# EAGLE design cnode_rev_a (EAGLE 7.6.0)
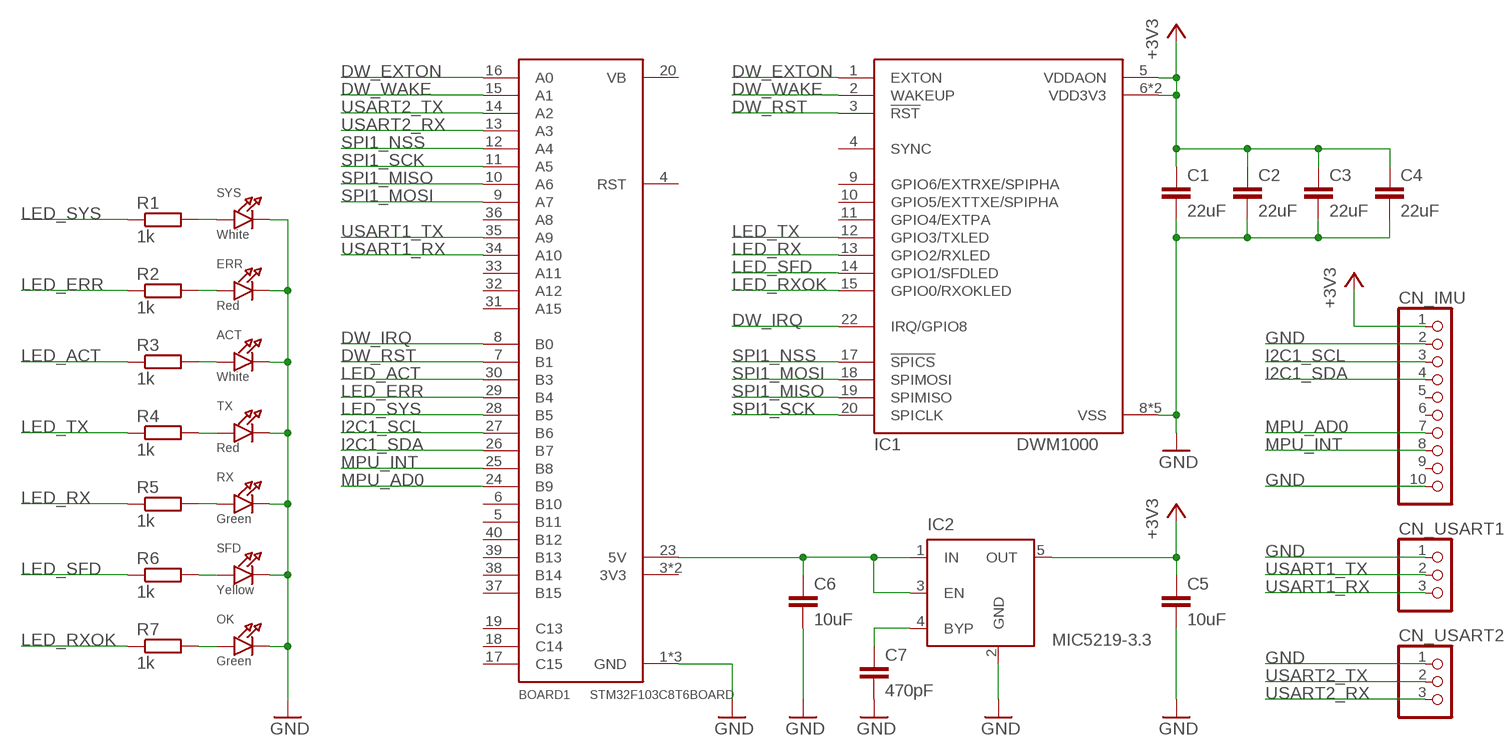
[diagram p0: schematic, sheet 1]

## Parts
ACT  White  LED0805_NOOUTLINE  [CHIPLED_0805_NOOUTLINE]
BOARD1  STM32F103C8T6BOARD  [STM32F103C8T6BOARD]
C1  22uF  C-EUC0805  [C0805]
C2  22uF  C-EUC0805  [C0805]
C3  22uF  C-EUC0805  [C0805]
C4  22uF  C-EUC0805  [C0805]
C5  10uF  C-EUC0805  [C0805]
C6  10uF  C-EUC0805  [C0805]
C7  470pF  C-EUC0805  [C0805]
CN_IMU  HEADER-1X10ROUND  [1X10_ROUND]
CN_USART1  HEADER-1X3ROUND  [1X03_ROUND]
CN_USART2  HEADER-1X3ROUND  [1X03_ROUND]
ERR  Red  LED0805_NOOUTLINE  [CHIPLED_0805_NOOUTLINE]
IC1  DWM1000  [DWM1000]
IC2  MIC5219-3.3  MIC5219XX  [SOT23-5]
OK  Green  LED0805_NOOUTLINE  [CHIPLED_0805_NOOUTLINE]
R1  1k  R-EU_R0805  [R0805]
R2  1k  R-EU_R0805  [R0805]
R3  1k  R-EU_R0805  [R0805]
R4  1k  R-EU_R0805  [R0805]
R5  1k  R-EU_R0805  [R0805]
R6  1k  R-EU_R0805  [R0805]
R7  1k  R-EU_R0805  [R0805]
RX  Green  LED0805_NOOUTLINE  [CHIPLED_0805_NOOUTLINE]
SFD  Yellow  LED0805_NOOUTLINE  [CHIPLED_0805_NOOUTLINE]
SYS  White  LED0805_NOOUTLINE  [CHIPLED_0805_NOOUTLINE]
TX  Red  LED0805_NOOUTLINE  [CHIPLED_0805_NOOUTLINE]

## Nets
+3V3: C1.1 C2.1 C3.1 C4.1 C5.1 CN_IMU.1 IC1.5(VDDAON) IC1.6(VDD3V3) IC1.7(VDD3V3) IC2.5(OUT)
DW_EXTON: BOARD1.16(A0) IC1.1(EXTON)
DW_IRQ: BOARD1.8(B0) IC1.22(IRQ/GPIO8)
DW_RST: BOARD1.7(B1) IC1.3(!RST)
DW_WAKE: BOARD1.15(A1) IC1.2(WAKEUP)
GND: ACT.C BOARD1.1(GND) BOARD1.2(GND) BOARD1.22(GND) C1.2 C2.2 C3.2 C4.2 C5.2 C6.2 C7.2 CN_IMU.2 CN_IMU.10 CN_USART1.1 CN_USART2.1 ERR.C IC1.8(VSS) IC1.16(VSS) IC1.21(VSS) IC1.23(VSS) IC1.24(VSS) IC2.2(GND) OK.C RX.C SFD.C SYS.C TX.C
I2C1_SCL: BOARD1.27(B6) CN_IMU.3
I2C1_SDA: BOARD1.26(B7) CN_IMU.4
LED_ACT: BOARD1.30(B3) R3.1
LED_ERR: BOARD1.29(B4) R2.1
LED_RX: IC1.13(GPIO2/RXLED) R5.1
LED_RXOK: IC1.15(GPIO0/RXOKLED) R7.1
LED_SFD: IC1.14(GPIO1/SFDLED) R6.1
LED_SYS: BOARD1.28(B5) R1.1
LED_TX: IC1.12(GPIO3/TXLED) R4.1
MPU_AD0: BOARD1.24(B9) CN_IMU.7
MPU_INT: BOARD1.25(B8) CN_IMU.8
N$1: R5.2 RX.A
N$2: R4.2 TX.A
N$3: ACT.A R3.2
N$4: ERR.A R2.2
N$5: R1.2 SYS.A
N$6: BOARD1.23(5V) C6.1 IC2.1(IN) IC2.3(EN)
N$7: C7.1 IC2.4(BYP)
N$8: R6.2 SFD.A
N$9: OK.A R7.2
SPI1_MISO: BOARD1.10(A6) IC1.19(SPIMISO)
SPI1_MOSI: BOARD1.9(A7) IC1.18(SPIMOSI)
SPI1_NSS: BOARD1.12(A4) IC1.17(!SPICS)
SPI1_SCK: BOARD1.11(A5) IC1.20(SPICLK)
USART1_RX: BOARD1.34(A10) CN_USART1.3
USART1_TX: BOARD1.35(A9) CN_USART1.2
USART2_RX: BOARD1.13(A3) CN_USART2.3
USART2_TX: BOARD1.14(A2) CN_USART2.2
Unconnected: BOARD1.3(3V3) BOARD1.4(RST) BOARD1.5(B11) BOARD1.6(B10) BOARD1.17(C15) BOARD1.18(C14) BOARD1.19(C13) BOARD1.20(VB) BOARD1.21(3V3) BOARD1.31(A15) BOARD1.32(A12) BOARD1.33(A11) BOARD1.36(A8) BOARD1.37(B15) BOARD1.38(B14) BOARD1.39(B13) BOARD1.40(B12) CN_IMU.5 CN_IMU.6 CN_IMU.9 IC1.4(SYNC) IC1.9(GPIO6/EXTRXE/SPIPHA) IC1.10(GPIO5/EXTTXE/SPIPHA) IC1.11(GPIO4/EXTPA)

## Library data of the parts
ACT ERR OK RX SFD SYS TX = microbuilder:LED: LED 0603 - 0603 Surface Mount Package 2mA: Green LED - Low Power (3.9mcd, 2ma, 1.7Vf) - Digikey: 475-2709-2-ND Orange LED - Low Power (9.8mcd, 2ma, 1.8Vf) - Digikey: 475-1194-2-ND Red LED - Low Power (5mcd, 2ma, 1.8Vf) - Digikey: 475-1195-2-ND Yellow LED - Low Power (7mcd, 2ma, 1.8Vf) - Digikey: 475-1196-2-ND 5mA: Blue LED - Low Power (17mcd, 5ma, 2.9Vf) - Digikey: LNJ937W8CRACT-ND 0805 - 0805 Surface Mount Package 2mA: Red LED (8.8mcd, 2mA, 1.8Vf, Clear) - Low Power [Digikey: 475-2510-1-ND] Green LED (5mcd, 2mA, 1.8Vf, Clear) - Low Power [Digikey: 475-2730-1-ND] Yellow LED (11.3mcd, 2mA, 1.8Vf, Clear) - Low Power [Digikey: 475-2555-1-ND] 20mA: Red LED (104mcd, 20mA, Diffused) - LS R976 [Digikey: 475-1278-6-ND] Red LED (12mcd, 20mA, 2.0Vf, Clear) - APT2012EC [Digikey: 754-1128-1-ND] Green LED (15mcd, 20mA, 2.2Vf, Clear) - APT2012GC [Digikey: 754-1131-1-ND] Orange LED (160mcd, 20mA, 2.1Vf, Clear) - APT2012SECK [Digikey: 754-1130-1-ND] 1206 - 1206 Surface Mount Package Green LED (26mcd, 20mA, Diffused) - LG N971 [Digikey: 475-1407-6-ND] Red LED (15mcd, 20mA, Diffused) - LH N974 [Digikey: 475-1416-6-ND]
BOARD1 = stm32board:STM32F103C8T6BOARD
C1-C7 = rcl:C-EU: CAPACITOR, European symbol
CN_IMU = microbuilder:HEADER-1X10: PIN HEADER
CN_USART1 CN_USART2 = microbuilder:HEADER-1X3: PIN HEADER
IC1 = decawave:DWM1000
IC2 = v-reg-micrel:MIC5219XX: VOLTAGE REGULATOR; OC_FARNELL: unknown; OC_NEWARK: unknown
R1-R7 = rcl:R-EU_: RESISTOR, European symbol

## Board
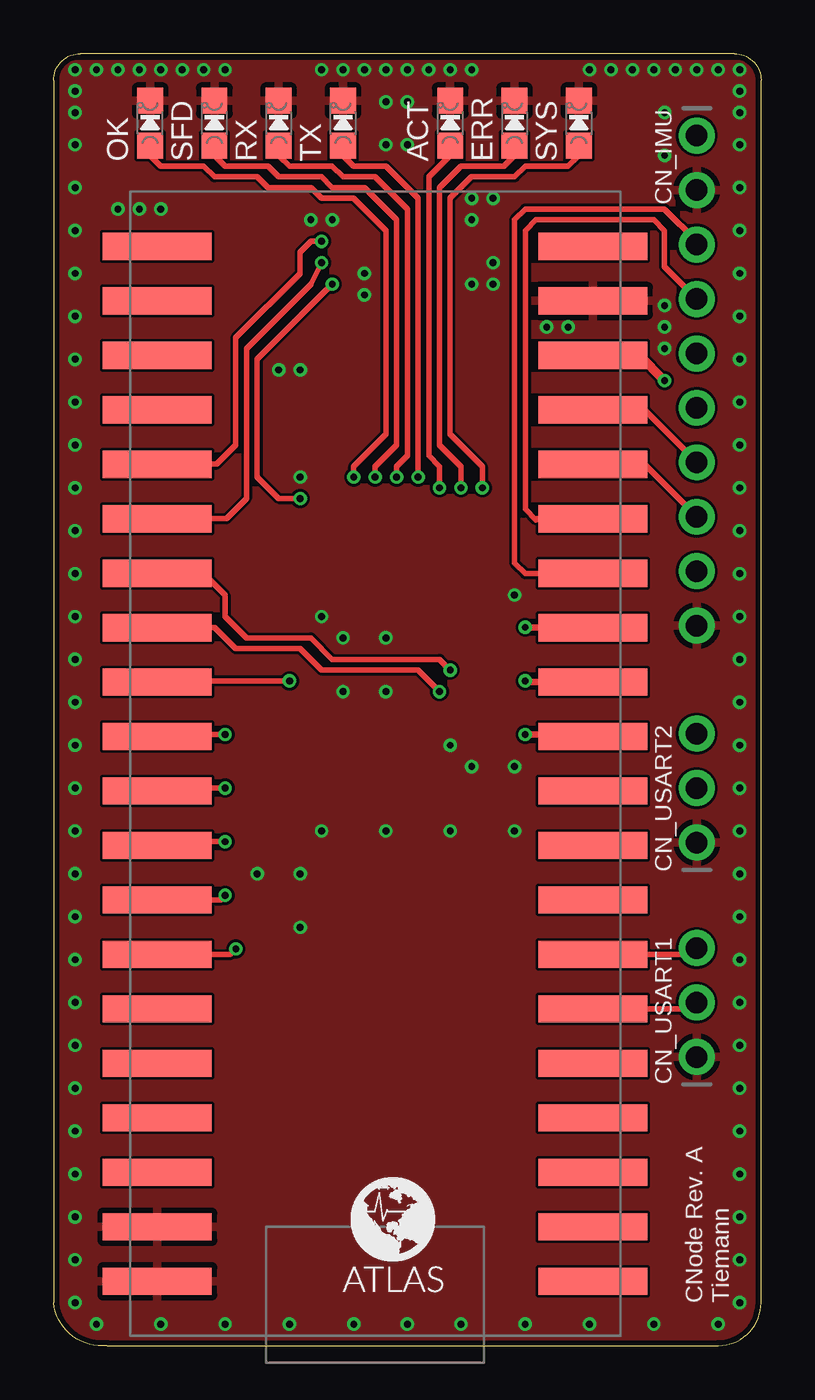
[diagram p1: board, top side]
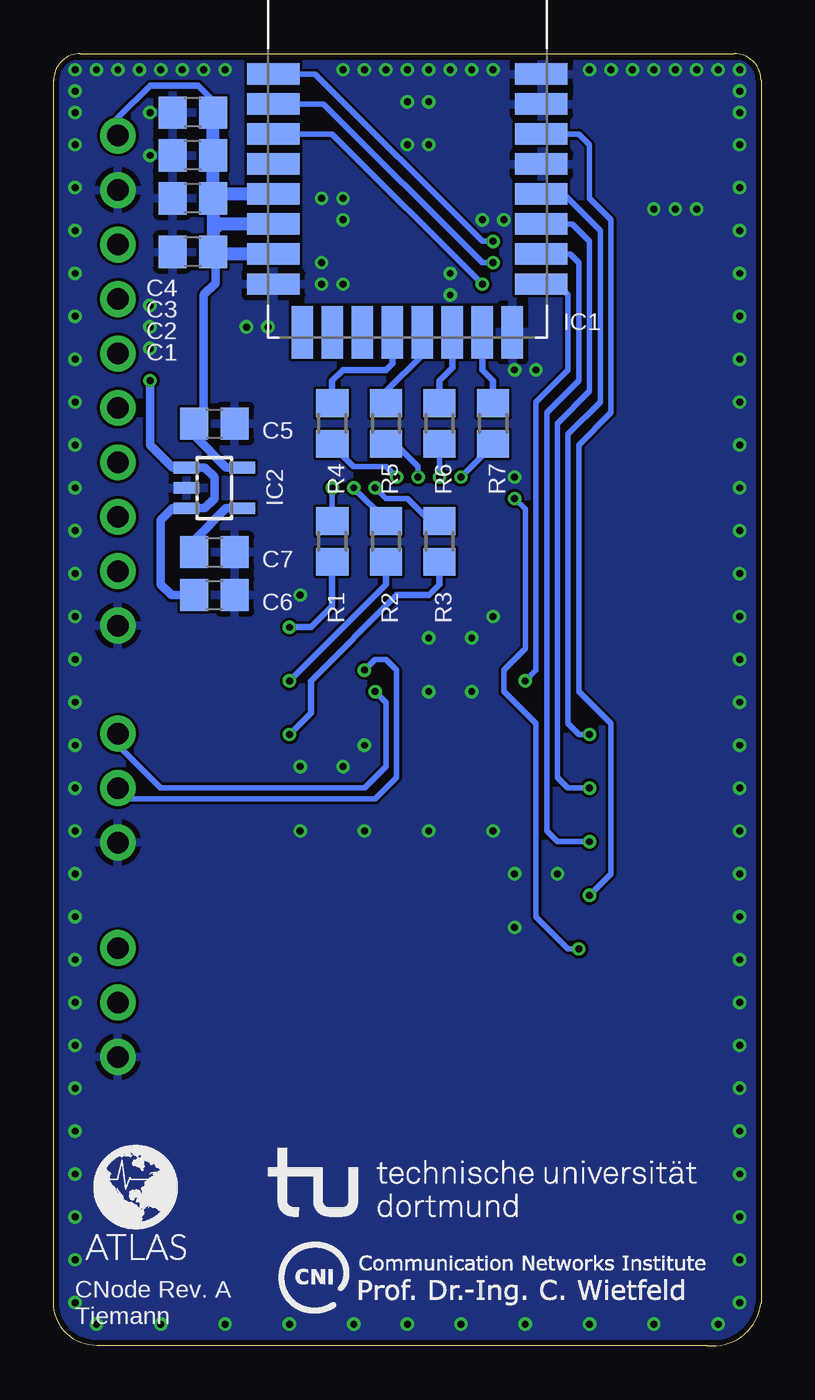
[diagram p2: board, bottom side, seen from below]

Size 33 x 60.26 mm. Coordinates in mm from the lower left corner, seen from the top.
Outline: 2.5,0.01 31,0.01 arc90 33,2.01 33,59.01 arc90 31.75,60.26 1.25,60.26 arc90 0,59.01 0,2.01 arc90 2.5,0.01
Copper layers (1*16): Top 0.035mm / dielectric 1.5mm / Bottom 0.035mm
Design rules "dirt_cheap_dirty_boards": minimum track width 5mil, minimum drill 12mil, track to track 5mil, track to pad 5mil, pad to pad 5mil, via to via 5mil, smd to smd 0mil, copper to edge 10mil, drill to drill 10mil, minimum pad ring 10mil, minimum via ring 6mil, stop-mask expansion 2mil, vias tented up to drill 25mil, thermal gap 10mil

### Footprints (pad centres in the part's own frame; a part is rotated, then mirrored left to right if it is on the bottom)
CHIPLED_0805_NOOUTLINE = smd 1.2 x 1.2: A 0,-1.05; C 0,1.05
STM32F103C8T6BOARD = smd 5.08 x 1.27: 1 -10.16,0; 2 -10.16,2.54; 3 -10.16,5.08; 4 -10.16,7.62; 5 -10.16,10.16; 6 -10.16,12.7; 7 -10.16,15.24; 8 -10.16,17.78; 9 -10.16,20.32; 10 -10.16,22.86; 11 -10.16,25.4; 12 -10.16,27.94; 13 -10.16,30.48; 14 -10.16,33.02; 15 -10.16,35.56; 16 -10.16,38.1; 17 -10.16,40.64; 18 -10.16,43.18; 19 -10.16,45.72; 20 -10.16,48.26; 21 10.16,48.26; 22 10.16,45.72; 23 10.16,43.18; 24 10.16,40.64; 25 10.16,38.1; 26 10.16,35.56; 27 10.16,33.02; 28 10.16,30.48; 29 10.16,27.94; 30 10.16,25.4; 31 10.16,22.86; 32 10.16,20.32; 33 10.16,17.78; 34 10.16,15.24; 35 10.16,12.7; 36 10.16,10.16; 37 10.16,7.62; 38 10.16,5.08; 39 10.16,2.54; 40 10.16,0
C0805 = smd 1.3 x 1.5: 1 -0.95,0; 2 0.95,0
1X10_ROUND = drill 1 pad 1.676: 1 -11.43,0; 2 -8.89,0; 3 -6.35,0; 4 -3.81,0; 5 -1.27,0; 6 1.27,0; 7 3.81,0; 8 6.35,0; 9 8.89,0; 10 11.43,0
1X03_ROUND = drill 1 pad 1.676: 1 -2.54,0; 2 0,0; 3 2.54,0
DWM1000 = smd 2.45 x 1: 1 -6.25,0.8; 2 -6.25,-0.6; 3 -6.25,-2; 4 -6.25,-3.4; 5 -6.25,-4.8; 6 -6.25,-6.2; 7 -6.25,-7.6; 8 -6.25,-9; 17 6.25,-9; 18 6.25,-7.6; 19 6.25,-6.2; 20 6.25,-4.8; 21 6.25,-3.4; 22 6.25,-2; 23 6.25,-0.6; 24 6.25,0.8 | smd 1 x 2.45: 9 -4.9,-11.25; 10 -3.5,-11.25; 11 -2.1,-11.25; 12 -0.7,-11.25; 13 0.7,-11.25; 14 2.1,-11.25; 15 3.5,-11.25; 16 4.9,-11.25
SOT23-5 = smd 0.55 x 1.2: 1 -0.95,-1.3; 2 0,-1.3; 3 0.95,-1.3; 4 0.95,1.3; 5 -0.95,1.3
R0805 = smd 1.3 x 1.5: 1 -0.95,0; 2 0.95,0

### Placement (x,y rotation side)
ACT  18.5,57.01 0 top
BOARD1  15,3.01 0 top
C1  26.5,53.51 180 bottom
C2  26.5,55.51 180 bottom
C3  26.5,57.51 180 bottom
C4  26.5,51.01 180 bottom
C5  25.5,43.01 0 bottom
C6  25.5,35.01 0 bottom
C7  25.5,37.01 0 bottom
CN_IMU  30,45.01 270 top
CN_USART1  30,16.01 90 top
CN_USART2  30,26.01 90 top
ERR  21.5,57.01 0 top
IC1  16.5,58.51 0 bottom
IC2  25.5,40.01 270 bottom
OK  4.5,57.01 0 top
R1  20,37.51 90 bottom
R2  17.5,37.51 90 bottom
R3  15,37.51 90 bottom
R4  20,43.01 270 bottom
R5  17.5,43.01 270 bottom
R6  15,43.01 270 bottom
R7  12.5,43.01 270 bottom
RX  10.5,57.01 0 top
SFD  7.5,57.01 0 top
SYS  24.5,57.01 0 top
TX  13.5,57.01 0 top
U$2  [ATLAS_LOGO_5MM]  31.5,4.01 0 bottom
U$4  [ATLAS_LOGO_5MM]  13.5,2.51 0 top
U$5  [CNI-BANNER-EN_20MM]  22.5,1.51 0 bottom
U$6  [TU-BANNER_20MM]  23,6.01 0 bottom

### Tracks (layer width: path | path; a pad name or v marks a point on that pad's centre or on a via)
+3V3
  Bottom 0.254: C3.1 25.55,58.06
  Bottom 0.305: CN_IMU.1 30,57.26 28.5,58.76 26.25,58.76 25.55,58.06
  Bottom 0.406: 25.5,50.96 C4.1 | 25.45,50.91 25.45,49.56 26,49.01 26,43.46 C5.1 26.45,42.46 24.95,40.96 IC2.5
  Bottom 0.61: 25.55,54.01 C1.1 25.55,52.01 | 25.55,54.01 C2.1 C3.1 | 25.55,52.01 C4.1 25.45,50.91 IC1.7 | IC1.6 25.25,52.31 25.55,52.01 | IC1.5 25.25,53.71 25.55,54.01
DW_EXTON  (via drill 0.32)
  Top 0.254: v12.5,51.51 12,51.51 11.5,51.01 11.5,50.01 8.5,47.01 8.5,42.01 7.6,41.11 BOARD1.16
  Bottom 0.254: IC1.1 20.8,59.31 13,51.51 v12.5,51.51
DW_IRQ  (via drill 0.32)
  Top 0.254: BOARD1.8 7.78,20.79 v8,21.01
  Bottom 0.254: IC1.22 8.5,56.51 8,56.01 8,53.51 7,52.51 7,43.51 8.5,42.01 8.5,30.51 7,29.01 7,22.01 v8,21.01
DW_RST  (via drill 0.32)
  Top 0.254: BOARD1.7 8.24,18.25 v8.5,18.51 | v13,49.51 9.5,46.01 9.5,40.51 10.5,39.51 v11.5,39.51
  Bottom 0.254: IC1.3 20,56.51 v13,49.51 | v11.5,39.51 11,39.01 11,32.51 12,31.51 12,30.51 10.5,29.01 10.5,20.01 9,18.51 v8.5,18.51
DW_WAKE  (via drill 0.32)
  Top 0.254: v12.5,50.51 12,49.51 9,46.51 9,39.51 8.06,38.57 BOARD1.15
  Bottom 0.254: IC1.2 20.4,57.91 13,50.51 v12.5,50.51
GND  (via drill 0.32)
  other vias: 14,1.01 12.5,59.51 13.5,59.51 14.5,59.51 15.5,59.51 16.5,59.51 17.5,59.51 18.5,59.51 19.5,59.51 8,59.51 7,59.51 6,59.51 5,59.51 4,59.51 3,59.51 30,59.51 29,59.51 1,8.01 16.5,1.01 11,1.01 1,4.01 5,1.01 25,1.01 1,6.01 1,10.01 1,14.01 22,1.01 19,1.01 28.5,48.51 28,59.51 27,59.51 26,59.51 25,59.51 11.5,45.51 11.5,22.01 11.5,19.51 9.5,22.01 12.5,34.01 13.5,33.01 12.5,24.01 2,1.01 8,1.01 23,47.51 15.5,58.01 15.5,56.01 16.5,58.01 18.5,28.01 15.5,24.01 18.5,24.01 19.5,27.01 21.5,24.01 21.5,27.01 20.5,49.51 24,47.51 31,59.51 28.5,55.51 28.5,57.51 20.5,50.51 19.5,49.51 16.5,56.01 2,59.51 3,53.01 4,53.01 5,53.01 13,52.51 14.5,50.01 10.5,45.51 21.5,35.01 28.5,47.51 28.5,46.51 32,4.01 32,6.01 1,59.51 32,59.51 1,58.51 20.5,53.51 19.5,53.51 19.5,52.51 13.5,30.51 15.5,30.51 15.5,33.01 1,50.01 1,48.01 1,46.01 1,44.01 1,12.01 11.5,40.51 28,1.01 32,8.01 32,10.01 1,57.51 1,56.01 32,12.01 1,54.01 1,52.01 32,58.51 32,57.51 32,56.01 1,2.01 31,1.01 32,2.01 1,16.01 1,18.01 1,20.01 1,22.01 1,24.01 1,26.01 1,28.01 1,30.01 1,32.01 1,34.01 1,36.01 1,38.01 1,40.01 1,42.01 32,14.01 32,16.01 32,18.01 32,20.01 32,22.01 32,24.01 32,26.01 32,28.01 32,30.01 32,32.01 32,34.01 32,36.01 32,38.01 32,40.01 32,42.01 32,44.01 32,46.01 32,48.01 32,50.01 32,52.01 32,54.01 12,52.51 14.5,49.01
  pour Bottom: 34.5,59.76 -1,59.76 -1,0.01 0,-0.99 34.5,-0.99
  pour Top: -2,59.76 33.5,59.76 33.5,-0.99 -2,-0.99
I2C1_SCL
  Top 0.254: BOARD1.27 25.64,36.01 22,36.01 21.5,36.51 21.5,52.51 22,53.01 28.5,53.01 30,51.51 CN_IMU.3
I2C1_SDA
  Top 0.254: BOARD1.26 22.56,38.57 22.5,38.51 22,39.01 22,52.01 22.5,52.51 28,52.51 28.5,52.01 28.5,50.32 CN_IMU.4
LED_ACT  (via drill 0.32)
  Top 0.305: v22,28.51 25.06,28.51 BOARD1.30
  Bottom 0.305: R3.1 15,35.51 15.5,35.01 17,35.01 21,31.01 21,29.51 v22,28.51
LED_ERR  (via drill 0.32)
  Top 0.305: BOARD1.29 22.06,30.95 v22,31.01
  Bottom 0.305: R2.1 17.5,35.51 v22,31.01
LED_RX
  Bottom 0.305: IC1.13 15.8,46.21 17.5,44.51 R5.1
LED_RXOK
  Bottom 0.305: IC1.15 13,45.51 12.5,45.01 R7.1
LED_SFD
  Bottom 0.305: IC1.14 14.4,45.61 15,45.01 R6.1
LED_SYS  (via drill 0.32)
  Top 0.305: BOARD1.28 22.02,33.49 v22,33.51
  Bottom 0.305: v22,33.51 21,33.51 20,34.51 R1.1
LED_TX
  Bottom 0.305: IC1.12 17.2,45.81 17.5,45.51 19.5,45.51 20,45.01 R4.1
MPU_AD0
  Top 0.254: BOARD1.24 27.55,43.65 CN_IMU.7
MPU_INT
  Top 0.254: BOARD1.25 27.55,41.11 CN_IMU.8
N$1  (via drill 0.32)
  Top 0.254: v16,40.51 16,41.01 16.5,41.51 16.5,53.01 15,54.51 13.5,54.51 13,55.01 11,55.01 10.5,55.51 RX.A
  Bottom 0.254: 17.45,42.01 17,42.01 16,41.01 v16,40.51
  Bottom 0.305: 17.45,42.01 R5.2
N$2  (via drill 0.32)
  Top 0.254: v17,40.51 17,53.51 15.5,55.01 14,55.01 13.5,55.51 TX.A
  Bottom 0.254: R4.2 20,42.01 19,41.01 17.5,41.01 v17,40.51
N$3  (via drill 0.32)
  Top 0.254: v18,40.01 18,41.01 17.5,41.51 17.5,54.51 18.5,55.51 ACT.A
  Bottom 0.254: v18,40.01 17.5,39.51 16.5,39.51 15.5,38.51 15.05,38.51 R3.2
  Bottom 0.305: R3.2 15,38.51
N$4  (via drill 0.32)
  Top 0.254: ERR.A 21.5,55.51 21,55.01 19,55.01 18,54.01 18,42.01 19,41.01 v19,40.01
  Bottom 0.254: 17.5,38.51 v19,40.01
  Bottom 0.305: R2.2 17.5,38.51
N$5  (via drill 0.32)
  Top 0.254: SYS.A 24.5,55.51 24,55.01 22,55.01 21.5,54.51 19.5,54.51 18.5,53.51 18.5,42.51 20,41.01 v20,40.01
  Bottom 0.254: R1.2 v20,40.01
N$6  (via drill 0.32)
  Top 0.406: v28.5,45.01 27.32,46.19 BOARD1.23
  Bottom 0.406: 28.45,44.96 v28.5,45.01 28.5,42.01 27.45,40.96 IC2.1 25.95,40.96 25.5,40.51 25.5,39.51 25.95,39.06 IC2.3 27.45,39.06 28,38.51 28,35.51 27.5,35.01 C6.1
N$7
  Bottom 0.406: IC2.4 24.95,39.06 26.45,37.56 C7.1
N$8  (via drill 0.32)
  Top 0.254: v15,40.51 15,41.01 16,42.01 16,52.51 14.5,54.01 13,54.01 12.5,54.51 10.5,54.51 10,55.01 8,55.01 7.5,55.51 SFD.A
  Bottom 0.254: R6.2 v15,40.51
N$9  (via drill 0.32)
  Top 0.254: v14,40.51 14,41.01 15.5,42.51 15.5,52.01 14,53.51 12.5,53.51 12,54.01 10,54.01 9.5,54.51 7.5,54.51 7,55.01 5,55.01 4.5,55.51 OK.A
  Bottom 0.254: 12.5,42.01 v14,40.51
  Bottom 0.305: R7.2 12.5,42.01
SPI1_MISO  (via drill 0.32)
  Top 0.254: v8,26.01 4.98,26.01 BOARD1.10
  Bottom 0.254: IC1.19 8.8,52.31 8,51.51 8,44.51 9.5,43.01 9.5,26.51 9,26.01 v8,26.01
SPI1_MOSI  (via drill 0.32)
  Top 0.254: v8,23.51 5.02,23.51 BOARD1.9
  Bottom 0.254: IC1.18 8.9,50.91 8.5,50.51 8.5,45.01 10,43.51 10,24.01 9.5,23.51 v8,23.51
SPI1_NSS  (via drill 0.32)
  Top 0.254: v11,31.01 4.9,31.01 BOARD1.12
  Bottom 0.254: IC1.17 9.5,49.51 9,49.01 9,45.51 10.5,44.01 10.5,31.51 v11,31.01
SPI1_SCK  (via drill 0.32)
  Top 0.254: v8,28.51 4.94,28.51 BOARD1.11
  Bottom 0.254: IC1.20 9.2,53.71 7.5,52.01 7.5,44.01 9,42.51 9,29.01 8.5,28.51 v8,28.51
USART1_RX
  Top 0.254: BOARD1.34 29.7,18.25 CN_USART1.3
USART1_TX
  Top 0.254: BOARD1.35 29.7,15.71 CN_USART1.2
USART2_RX  (via drill 0.32)
  Top 0.254: BOARD1.13 7.52,33.49 8.5,32.51 11.5,32.51 12.5,31.51 17,31.51 v18,30.51
  Bottom 0.254: CN_USART2.3 30,28.01 28,26.01 18.5,26.01 17.5,27.01 17.5,30.01 v18,30.51
USART2_TX  (via drill 0.32)
  Top 0.254: BOARD1.14 6.98,36.03 8,35.01 8,34.01 9,33.01 12,33.01 13,32.01 18,32.01 v18.5,31.51
  Bottom 0.254: v18.5,31.51 18,32.01 17.5,32.01 17,31.51 17,26.51 18,25.51 29.5,25.51 CN_USART2.2

### Text on the board
tPlace: CNode Rev. A / Tiemann
bPlace: CNode Rev. A / Tiemann